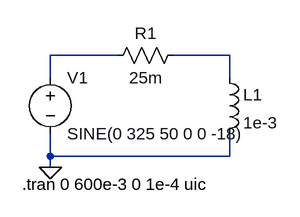
[diagram p0: schematic tran_network7.asc]
tran_network7.asc, the LTspice schematic file:
Version 4
SHEET 1 880 680
WIRE 208 112 112 112
WIRE 368 112 288 112
WIRE 112 144 112 112
WIRE 368 144 368 112
WIRE 112 256 112 224
WIRE 368 256 368 224
WIRE 368 256 112 256
WIRE 112 272 112 256
FLAG 112 272 0
SYMBOL voltage 112 128 R0
WINDOW 123 0 0 Left 2
WINDOW 39 0 0 Left 2
SYMATTR InstName V1
SYMATTR Value SINE(0 325 50 0 0 -18)
SYMBOL res 304 96 R90
WINDOW 0 0 56 VBottom 2
WINDOW 3 32 56 VTop 2
SYMATTR InstName R1
SYMATTR Value 25m
SYMBOL ind 352 128 R0
SYMATTR InstName L1
SYMATTR Value 1e-3
SYMATTR SpiceLine Rser=0
TEXT 72 296 Left 2 !.tran 0 600e-3 0 1e-4 uic

The netlist it stands for:
* tran_network7.asc
V1 N001 0 SINE(0 325 50 0 0 -18)
R1 N002 N001 25m
L1 N002 0 1e-3 Rser=0
.tran 0 600e-3 0 1e-4 uic
.backanno
.end